# Altium schematic sheet PLC1_4.SchDoc
size 420 x 297 mm; SheetNumber: 4; Scale: {Масш.}; Title1str: {Наименование}; PageSetup: Record=PageOptions|CenterHorizontal=False|CenterVertical=False|PrintScale=0.67|XCorrection=0.00|YCorrection=0.00|PrintKind=1|BorderSize=5000000|LeftOffset=0|BottomOffset=0|Orientation=2|PaperLength=1000|PaperWidth=1000|Scale=100|PaperSource=7|PrintQuality=600|MediaType=1|DitherType=10|PaperKind=A4|PrintScaleMode=1; Title2str: {Наименование}; ProcessInspection: {Т.контр.}; Mass: {Масса}; NormInspection: {Н.контр.}; EngineerName: {Инженер}; Letter1Column: {}; Letter2Column: {}; Letter3Column: {}; DocumentType: ?????????????? ?????; DocumentType1str: {Документ}; DocumentType2str: {Документ}
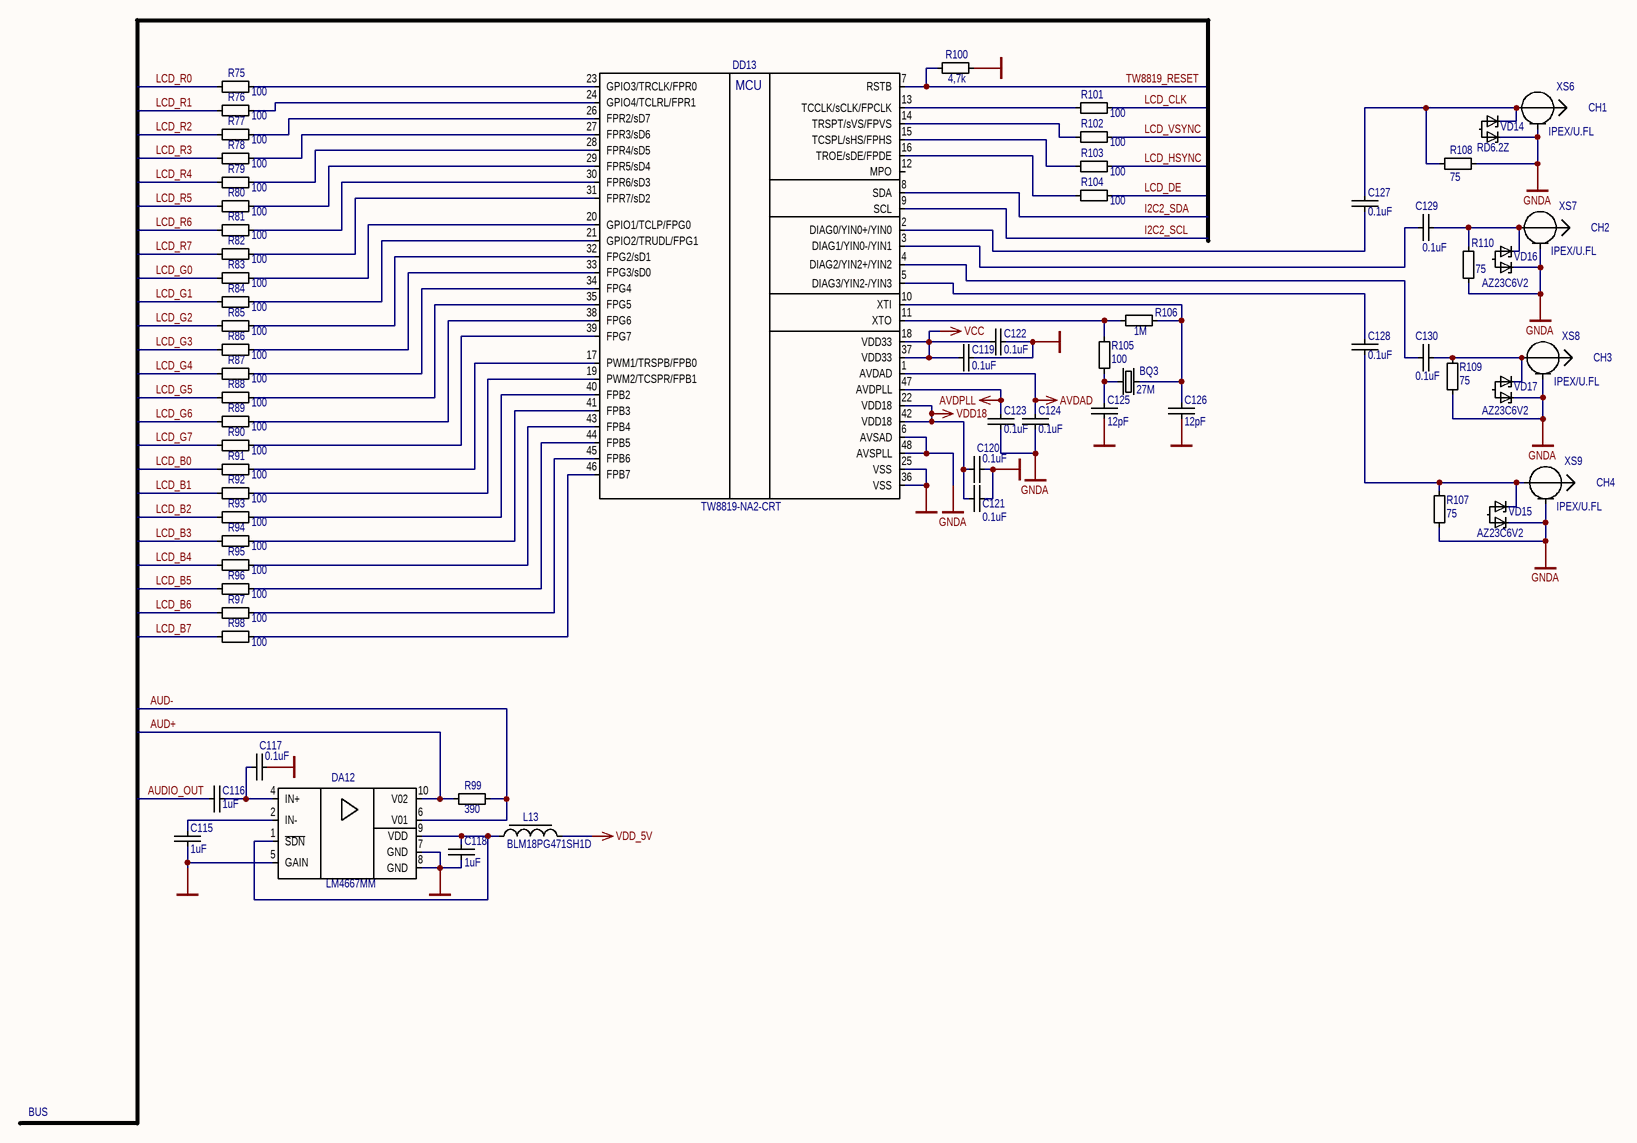
[diagram p0: PLC1_4.SchDoc]

## Parts
BQ3  value 27M  [TSX-3225]  (hidden comment: TSX-3225)
C115  1uF  [CAP_0603]
C116  1uF  [CAP_0603]
C117  0.1uF  [CAP_0603]
C118  1uF  [CAP_0603]
C119  0.1uF  [CAP_0603]
C120  0.1uF  [CAP_0603]
C121  0.1uF  [CAP_0603]
C122  0.1uF  [CAP_0603]
C123  0.1uF  [CAP_0603]
C124  0.1uF  [CAP_0603]
C125  12pF  [CAP_0603]
C126  12pF  [CAP_0603]
C127  0.1uF  [CAP_0603]
C128  0.1uF  [CAP_0603]
C129  0.1uF  [CAP_0603]
C130  0.1uF  [CAP_0603]
DA12  value LM4667MM  [S-PDSO-G10]  (hidden comment: LM4667MM/NOPB)
DD13  TW8819-NA2-CRT  [QFN48.7x7]
L13  BLM18PG471SH1D  [R_IND_0603]
R75  value 100  [RES_0402]  (hidden comment: Res_0402)
R76  value 100  [RES_0402]  (hidden comment: Res_0402)
R77  value 100  [RES_0402]  (hidden comment: Res_0402)
R78  value 100  [RES_0402]  (hidden comment: Res_0402)
R79  value 100  [RES_0402]  (hidden comment: Res_0402)
R80  value 100  [RES_0402]  (hidden comment: Res_0402)
R81  value 100  [RES_0402]  (hidden comment: Res_0402)
R82  value 100  [RES_0402]  (hidden comment: Res_0402)
R83  value 100  [RES_0402]  (hidden comment: Res_0402)
R84  value 100  [RES_0402]  (hidden comment: Res_0402)
R85  value 100  [RES_0402]  (hidden comment: Res_0402)
R86  value 100  [RES_0402]  (hidden comment: Res_0402)
R87  value 100  [RES_0402]  (hidden comment: Res_0402)
R88  value 100  [RES_0402]  (hidden comment: Res_0402)
R89  value 100  [RES_0402]  (hidden comment: Res_0402)
R90  value 100  [RES_0402]  (hidden comment: Res_0402)
R91  value 100  [RES_0402]  (hidden comment: Res_0402)
R92  value 100  [RES_0402]  (hidden comment: Res_0402)
R93  value 100  [RES_0402]  (hidden comment: Res_0402)
R94  value 100  [RES_0402]  (hidden comment: Res_0402)
R95  value 100  [RES_0402]  (hidden comment: Res_0402)
R96  value 100  [RES_0402]  (hidden comment: Res_0402)
R97  value 100  [RES_0402]  (hidden comment: Res_0402)
R98  value 100  [RES_0402]  (hidden comment: Res_0402)
R99  390  [RES_0603]
R100  4,7k  [RES_0603]
R101  value 100  [RES_0402]  (hidden comment: Res_0402)
R102  value 100  [RES_0402]  (hidden comment: Res_0402)
R103  value 100  [RES_0402]  (hidden comment: Res_0402)
R104  value 100  [RES_0402]  (hidden comment: Res_0402)
R105  value 100  [RES_0402]  (hidden comment: Res_0402)
R106  value 1M  [RES_0402]  (hidden comment: Res_0402)
R107  75  [RES_0603]
R108  75  [RES_0603]
R109  75  [RES_0603]
R110  75  [RES_0603]
VD14  RD6.2Z  [SC-59]
VD15  Part Number: AZ23C6V2  [SC-59]  (hidden comment: RD6.2Z)
VD16  Part Number: AZ23C6V2  [SC-59]  (hidden comment: RD6.2Z)
VD17  Part Number: AZ23C6V2  [SC-59]  (hidden comment: RD6.2Z)
XS6  IPEX/U.FL  [IPEX MHFI]
XS7  IPEX/U.FL  [IPEX MHFI]
XS8  IPEX/U.FL  [IPEX MHFI]
XS9  IPEX/U.FL  [IPEX MHFI]

## Nets
AVDAD: C124.1 DD13.1(AVDAD)
AVDPLL: C123.1 DD13.47(AVDPLL)
GND: C115.1 C117.2 C118.1 C119.2 C120.2 C121.2 C122.2 C125.1 C126.1 DA12.5(GAIN) DA12.7(GND) DA12.8(GND) DD13.25(VSS) DD13.36(VSS) R100.2
GNDA: C123.2 C124.2 DD13.6(AVSAD) DD13.48(AVSPLL) R107.1 R108.2 R109.1 R110.2 VD14.2 VD15.2 VD16.2 VD17.2 XS6.2 XS7.2 XS8.2 XS9.2
VCC: C119.1 C122.1 DD13.18(VDD33) DD13.37(VDD33)
VDD18: C120.1 C121.1 DD13.22(VDD18) DD13.42(VDD18)
VDD_5V: L13.1
AUD+: DA12.10(V02) R99.2
AUD-: DA12.6(V01) R99.1
AUDIO_OUT: C116.2
I2C2_SCL: DD13.9(SCL)
I2C2_SDA: DD13.8(SDA)
LCD_B0: R91.2
LCD_B1: R92.2
LCD_B2: R93.2
LCD_B3: R94.2
LCD_B4: R95.2
LCD_B5: R96.2
LCD_B6: R97.2
LCD_B7: R98.2
LCD_CLK: R101.2
LCD_DE: R104.2
LCD_G0: R83.2
LCD_G1: R84.2
LCD_G2: R85.2
LCD_G3: R86.2
LCD_G4: R87.2
LCD_G5: R88.2
LCD_G6: R89.2
LCD_G7: R90.2
LCD_HSYNC: R103.2
LCD_R0: R75.2
LCD_R1: R76.2
LCD_R2: R77.2
LCD_R3: R78.2
LCD_R4: R79.2
LCD_R5: R80.2
LCD_R6: R81.2
LCD_R7: R82.2
LCD_VSYNC: R102.2
TW8819_RESET: DD13.7(RSTB) R100.1
NetBQ3_1: BQ3.1 C126.2 DD13.10(XTI) R106.1
NetBQ3_2: BQ3.2 C125.2 R105.1
NetC115_2: C115.2 DA12.2(IN-)
NetC116_1: C116.1 C117.1 DA12.4(IN+)
NetC118_2: C118.2 DA12.1(~{SDN}) DA12.9(VDD) L13.2
NetC127_1: C127.1 R108.1 VD14.1 XS6.1
NetC127_2: C127.2 DD13.2(DIAG0/YIN0+/YIN0)
NetC128_1: C128.1 DD13.5(DIAG3/YIN2-/YIN3)
NetC128_2: C128.2 R107.2 VD15.1 XS9.1
NetC129_1: C129.1 DD13.3(DIAG1/YIN0-/YIN1)
NetC129_2: C129.2 R110.1 VD16.1 XS7.1
NetC130_1: C130.1 DD13.4(DIAG2/YIN2+/YIN2)
NetC130_2: C130.2 R109.2 VD17.1 XS8.1
NetDD13_11: DD13.11(XTO) R105.2 R106.2
NetDD13_13: DD13.13(TCCLK/sCLK/FPCLK) R101.1
NetDD13_14: DD13.14(TRSPT/sVS/FPVS) R102.1
NetDD13_15: DD13.15(TCSPL/sHS/FPHS) R103.1
NetDD13_16: DD13.16(TROE/sDE/FPDE) R104.1
NetDD13_17: DD13.17(PWM1/TRSPB/FPB0) R91.1
NetDD13_19: DD13.19(PWM2/TCSPR/FPB1) R92.1
NetDD13_20: DD13.20(GPIO1/TCLP/FPG0) R83.1
NetDD13_21: DD13.21(GPIO2/TRUDL/FPG1) R84.1
NetDD13_23: DD13.23(GPIO3/TRCLK/FPR0) R75.1
NetDD13_24: DD13.24(GPIO4/TCLRL/FPR1) R76.1
NetDD13_26: DD13.26(FPR2/sD7) R77.1
NetDD13_27: DD13.27(FPR3/sD6) R78.1
NetDD13_28: DD13.28(FPR4/sD5) R79.1
NetDD13_29: DD13.29(FPR5/sD4) R80.1
NetDD13_30: DD13.30(FPR6/sD3) R81.1
NetDD13_31: DD13.31(FPR7/sD2) R82.1
NetDD13_32: DD13.32(FPG2/sD1) R85.1
NetDD13_33: DD13.33(FPG3/sD0) R86.1
NetDD13_34: DD13.34(FPG4) R87.1
NetDD13_35: DD13.35(FPG5) R88.1
NetDD13_38: DD13.38(FPG6) R89.1
NetDD13_39: DD13.39(FPG7) R90.1
NetDD13_40: DD13.40(FPB2) R93.1
NetDD13_41: DD13.41(FPB3) R94.1
NetDD13_43: DD13.43(FPB4) R95.1
NetDD13_44: DD13.44(FPB5) R96.1
NetDD13_45: DD13.45(FPB6) R97.1
NetDD13_46: DD13.46(FPB7) R98.1

Not connected (* = marked no-connect by the designer): DD13 12(MPO); VD14 3; VD15 3; VD16 3; VD17 3

## Notes on the sheet
- (near XS6) CH1
- (near XS7) CH2
- (near XS8) CH3
- (near XS9) CH4
- BUS
- Подп. и дата
- Инв. № дубл.
- Взам. инв. №
- Инв. № подл.
- Изм.
- Лист
- № докум.
- Подп.
- Дата
- 2.106-A3
- Копировал
- Формат А3
- (in symbol TW8819-NA2-CRT) MCU

## Library data of the parts
BQ3 = TSX-3225: Manufacturer: EPSON; Part Number: EPSON TSX-3225 27.0000MF10Z-K3; Replacement: TSX-3225 27.0000MF10Z-AC0-ND; PackageReference: TSX-3225
C115 C116 C118 = Cap_0603: Manufacturer: AVX; Part Number: 0603YC105KAT2A; Replacement: 0603YD105KAT2A; PackageReference: 0603; Value: 1uF; Distributor: http://www.rospek.ru; Price: 0.001$
C117 C119-C124 C127-C130 = Cap_0603: Manufacturer: AVX; Part Number: 0603YC104KAT2A; Replacement: GRM188R71E104KA12D; PackageReference: 0603; Value: 0.1uF; Distributor: http://www.rospek.ru; Price: 0.001$
C125 C126 = Cap_0603: Manufacturer: Murata; Part Number: GRM1885C1H120JA01D; Replacement: 12pF 0603 NP0; PackageReference: 0603; Value: 12pF; Distributor: http://www.rospek.ru; Price: 0.001$
DA12 = LM4667MM/NOPB: Manufacturer: TEXAS INSTRUMENTS; Price: 0.6$; Distributor: TE; Replacement: LM4667MM/NOPB; PackageReference: VSSOP-10; Part Number: LM4667MM/NOPB
DD13 = TW8819-NA2-CRT: Manufacturer: Intersil; Price: 4.00$; Replacement: TW8819-NA2-CRT; PackageReference: WFQFN; TW8819-NA2-CRT: TW8819-NA2-CRT; Type: power
L13 = FCM1608KF-601T03: Manufacturer: Murata; Replacement: 600 ohm @100 MHz; PackageReference: 0603; Part Number: BLM18PG471SH1D; Distributor: http://www.chipdip.ru; Price: 0.1$; Value: BLM18PG471SH1D
R75-R98 R101-R105 = Res_0402: 0402; Manufacturer: BOURNS; Part Number: CR0402-FX-1000GLF; Replacement: 0402 100 Ohm 5%; PackageReference: 0402; Distributor: http://www.kontest.ru; Price: 0.01$
R99 = Res_0603: 0603, 390; Manufacturer: YAGEO; Part Number: RC0603FR-07390RL; Replacement: 0603 390 5%; PackageReference: 0603; Value: 390; Price: 0.004$
R100 = Res_0603: 0603, 100; Manufacturer: Vishay; Part Number: CRCW0603-472JRT1; Replacement: 0603 4.7 kOhm 5%; PackageReference: 0603; Value: 4,7k; Distributor: http://www.kontest.ru; Price: 0.01$
R106 = Res_0402: 0402; Manufacturer: BOURNS; Part Number: RC0402JR-071ML; Replacement: 0402 1 MOhm 5%; PackageReference: 0402; Distributor: http://www.kontest.ru; Price: 0.01$
R107-R110 = Res_0603: 0603; Manufacturer: YAGEO; Part Number: RC0603JR-0775RL; Replacement: 0603 75 Ohm 5%; PackageReference: 0603; Distributor: http://www.kontest.ru; Price: 0.01$; Value: 75
VD14-VD17 = RD6.2Z: Manufacturer: NEC; Price: 0.1$
  VD14: Part Number: RD6.2Z
  VD15-VD17: Replacement: RD6.2Z
XS6-XS9 = IPEX/U.FL: IPEX/U.FL male pcb SMT; Manufacturer: taoglas limited; Part Number: 20279-001E-01; Replacement: J983TR-ND; PackageReference: IPEX/U.FL